# Altium schematic sheet SolarConnections.SchDoc: Solar Panels Connections
size A4; Author: Michał Gumiela; DocumentNumber: 5; SheetNumber: 5; SheetTotal: 16; Model: EM1; PageSetup: Record=PageOptions|CenterHorizontal=True|CenterVertical=True|PrintScale=0.52|XCorrection=1.00|YCorrection=1.00|PrintKind=1|BorderSize=5000000|LeftOffset=0|BottomOffset=0|Orientation=2|PaperLength=4200|PaperWidth=2970|Scale=100|PaperSource=7|PrintQuality=600|MediaType=1|DitherType=10|PaperKind=A3|PrintScaleMode=1
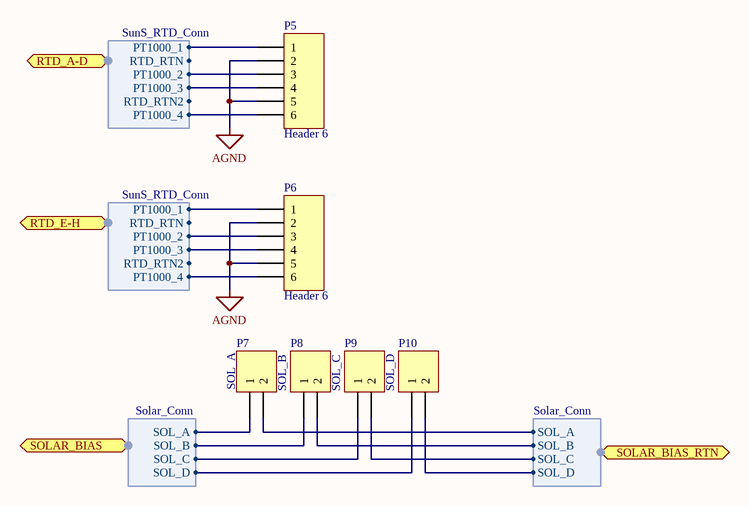
[diagram p0: SolarConnections.SchDoc]

## Parts
P5  Header 6  [HDR1X6]
P6  Header 6  [HDR1X6]
P7  SOL_A  [HDR1X2]
P8  SOL_B  [HDR1X2]
P9  SOL_C  [HDR1X2]
P10  SOL_D  [HDR1X2]

## Ports
RTD_A-D (harness SunS_RTD_Conn), RTD_E-H (harness SunS_RTD_Conn), SOLAR_BIAS (harness Solar_Conn), SOLAR_BIAS_RTN (harness Solar_Conn)

## Harnesses
Solar_Conn: SOL_A, SOL_B, SOL_C, SOL_D
SunS_RTD_Conn: PT1000_1, PT1000_2, PT1000_3, PT1000_4, RTD_RTN2, RTD_RTN

## Nets
AGND: P5.2 P5.5 P6.2 P6.5
NetP5_1: P5.1 ; port RTD_A-D.PT1000_1
NetP5_3: P5.3 ; port RTD_A-D.PT1000_2
NetP5_4: P5.4 ; port RTD_A-D.PT1000_3
NetP5_6: P5.6 ; port RTD_A-D.PT1000_4
NetP6_1: P6.1 ; port RTD_E-H.PT1000_1
NetP6_3: P6.3 ; port RTD_E-H.PT1000_2
NetP6_4: P6.4 ; port RTD_E-H.PT1000_3
NetP6_6: P6.6 ; port RTD_E-H.PT1000_4
NetP7_1: P7.1 ; port SOLAR_BIAS.SOL_A
NetP7_2: P7.2 ; port SOLAR_BIAS_RTN.SOL_A
NetP8_1: P8.1 ; port SOLAR_BIAS.SOL_B
NetP8_2: P8.2 ; port SOLAR_BIAS_RTN.SOL_B
NetP9_1: P9.1 ; port SOLAR_BIAS.SOL_C
NetP9_2: P9.2 ; port SOLAR_BIAS_RTN.SOL_C
NetP10_1: P10.1 ; port SOLAR_BIAS.SOL_D
NetP10_2: P10.2 ; port SOLAR_BIAS_RTN.SOL_D

## Notes on the sheet
- Title:
- Sheet:
- of
- Author:
- Model:
- Document Number:
- Checked by:
- Iss-Rev:
- Approved by:
- Date:
- File name:

## Library data of the parts
P5 P6 = Header 6: Header, 6-Pin; LatestRevisionDate: 17-Jul-2002; LatestRevisionNote: Re-released for DXP Platform.; Publisher: Altium Limited
P7-P10 = Header 2: Header, 2-Pin; LatestRevisionDate: 17-Jul-2002; LatestRevisionNote: Re-released for DXP Platform.; Publisher: Altium Limited